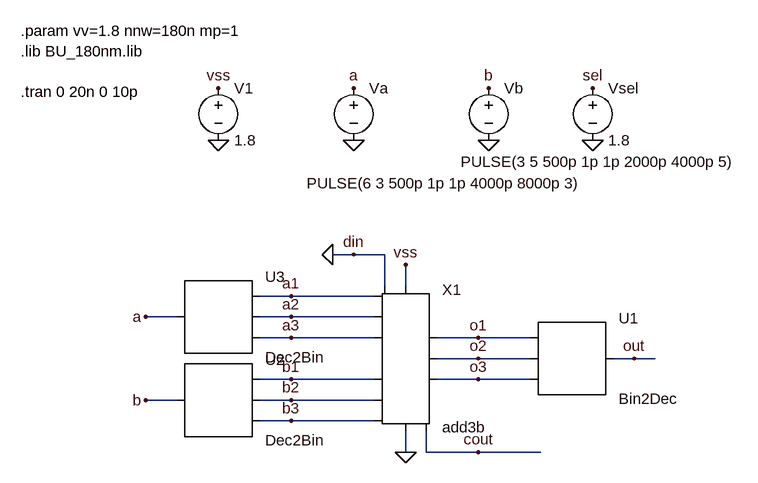
[diagram p0: schematic add3b_test.asc]
add3b_test.asc, the LTspice schematic file:
Version 4
SHEET 1 1040 680
WIRE 352 160 320 160
WIRE 400 160 352 160
WIRE 400 208 400 160
WIRE 432 208 432 176
WIRE 256 224 208 224
WIRE 384 224 256 224
WIRE 80 256 32 256
WIRE 256 256 208 256
WIRE 384 256 256 256
WIRE 256 288 208 288
WIRE 384 288 256 288
WIRE 544 288 480 288
WIRE 624 288 544 288
WIRE 544 320 480 320
WIRE 624 320 544 320
WIRE 784 320 752 320
WIRE 816 320 784 320
WIRE 256 352 208 352
WIRE 384 352 256 352
WIRE 544 352 480 352
WIRE 624 352 544 352
WIRE 80 384 32 384
WIRE 256 384 208 384
WIRE 384 384 256 384
WIRE 256 416 208 416
WIRE 384 416 256 416
WIRE 432 464 432 432
WIRE 464 464 464 432
WIRE 544 464 464 464
WIRE 640 464 544 464
FLAG 784 320 out
FLAG 432 176 vss
FLAG 432 464 0
FLAG 144 -16 0
FLAG 352 -16 0
FLAG 560 -16 0
FLAG 144 -96 vss
FLAG 352 -96 a
FLAG 560 -96 b
FLAG 32 256 a
FLAG 32 384 b
FLAG 720 -16 0
FLAG 720 -96 sel
FLAG 320 160 0
FLAG 544 352 o3
FLAG 544 320 o2
FLAG 544 288 o1
FLAG 544 464 cout
FLAG 256 224 a1
FLAG 256 256 a2
FLAG 256 288 a3
FLAG 256 352 b1
FLAG 256 384 b2
FLAG 256 416 b3
FLAG 352 160 din
SYMBOL Bin2Dec 688 320 R0
SYMATTR InstName U1
SYMATTR SpiceLine Vhigh={vv}
SYMBOL Dec2Bin 144 384 R0
SYMATTR InstName U2
SYMATTR SpiceLine Vhigh={vv}
SYMBOL Dec2Bin 144 256 R0
SYMATTR InstName U3
SYMATTR SpiceLine Vhigh={vv}
SYMBOL /voltage 144 -112 R0
SYMATTR InstName V1
SYMATTR Value 1.8
SYMBOL /voltage 352 -112 R0
WINDOW 3 -72 162 Left 2
SYMATTR InstName Va
SYMATTR Value PULSE(6 3 500p 1p 1p 4000p 8000p 3)
SYMBOL /voltage 560 -112 R0
WINDOW 3 -43 129 Left 2
SYMATTR InstName Vb
SYMATTR Value PULSE(3 5 500p 1p 1p 2000p 4000p 5)
SYMBOL /voltage 720 -112 R0
SYMATTR InstName Vsel
SYMATTR Value 1.8
SYMBOL add3b 432 320 R0
SYMATTR InstName X1
SYMATTR SpiceLine ll=180n wn={nnw} wp={nnw*mp}
TEXT -160 -184 Left 2 !.param vv=1.8 nnw=180n mp=1\n.lib BU_180nm.lib\n \n.tran 0 20n 0 10p

The netlist it stands for:
* add3b_test.asc
XU1 o1 o2 o3 out Bin2Dec Vhigh={vv}
XU2 b b1 b2 b3 Dec2Bin Vhigh={vv}
XU3 a a1 a2 a3 Dec2Bin Vhigh={vv}
V1 vss 0 1.8
Va a 0 PULSE(6 3 500p 1p 1p 4000p 8000p 3)
Vb b 0 PULSE(3 5 500p 1p 1p 2000p 4000p 5)
Vsel sel 0 1.8
XX1 vss a1 a2 a3 b1 b2 b3 0 o1 o2 o3 cout 0 add3b params: ll=180n wn={nnw} wp={nnw*mp}
.param vv=1.8 nnw=180n mp=1
.lib BU_180nm.lib
.tran 0 20n 0 10p
.lib BIN2DEC.sub
.lib DEC2BIN.sub
.backanno
.end